# Altium schematic sheet Interface Connector.SchDoc
size A4; Author: Thomas Kreppel; CompanyName: Universidad de Santiago de Chile; Address1: Avenida Ecuador Nº 3519; Address2: Estación Central, Santiago; Address3: Chile; DocumentNumber: 2; SheetNumber: 2; SheetTotal: 5
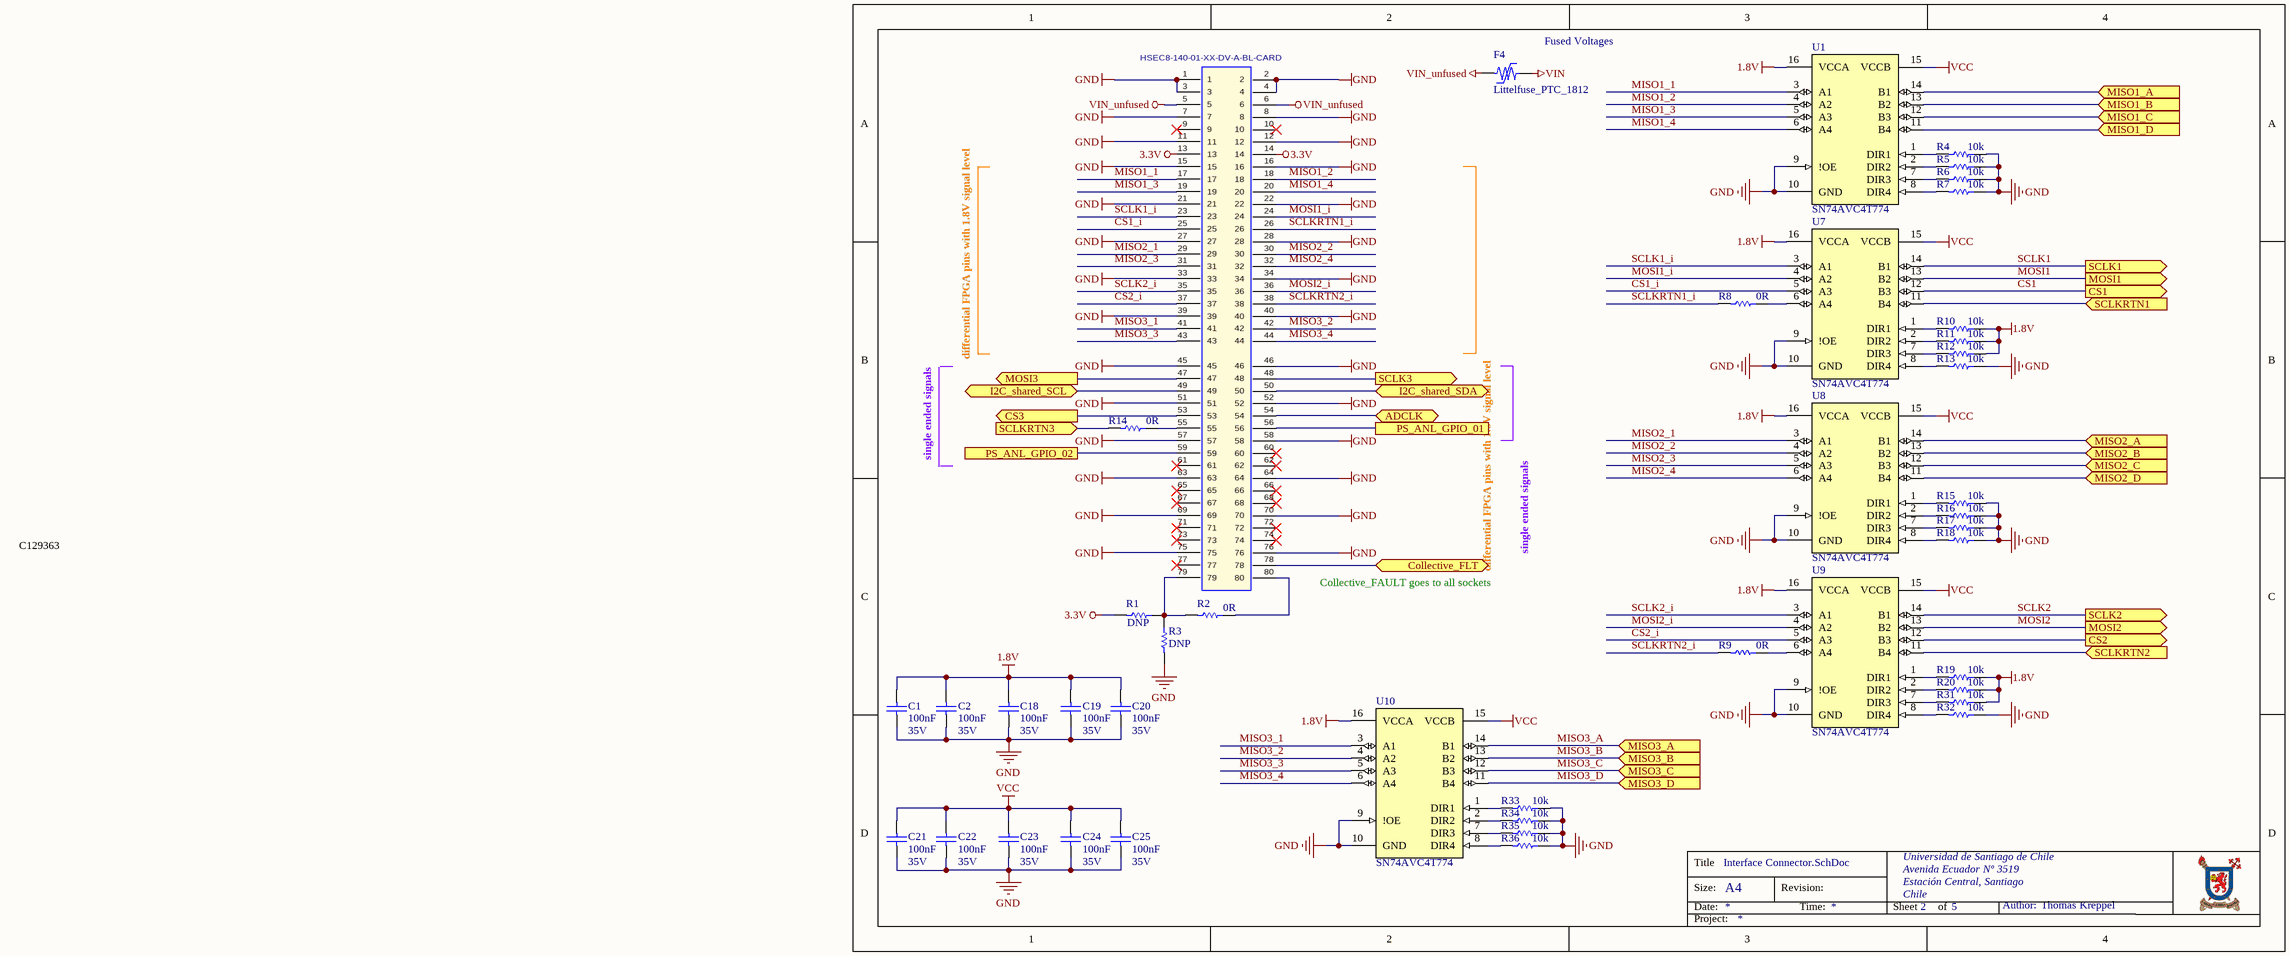
[diagram p0: Interface Connector.SchDoc]

## Parts
C1  100nF  Voltage: 35V  [CAP_0603]
C2  100nF  Voltage: 35V  [CAP_0603]
C18  100nF  Voltage: 35V  [CAP_0603]
C19  100nF  Voltage: 35V  [CAP_0603]
C20  100nF  Voltage: 35V  [CAP_0603]
C21  100nF  Voltage: 35V  [CAP_0603]
C22  100nF  Voltage: 35V  [CAP_0603]
C23  100nF  Voltage: 35V  [CAP_0603]
C24  100nF  Voltage: 35V  [CAP_0603]
C25  100nF  Voltage: 35V  [CAP_0603]
F4  Littelfuse_PTC_1812  [1812_PTC_Polyfuse_Littelfuse]
R1  DNP  [RES_0603]  (no BOM)
R2  0R  [RES_0603]
R3  DNP  [RES_0603]  (no BOM)
R4  10k  [RES_0603]
R5  10k  [RES_0603]
R6  10k  [RES_0603]
R7  10k  [RES_0603]
R8  0R  [RES_0603]
R9  0R  [RES_0603]
R10  10k  [RES_0603]
R11  10k  [RES_0603]
R12  10k  [RES_0603]
R13  10k  [RES_0603]
R14  0R  [RES_0603]
R15  10k  [RES_0603]
R16  10k  [RES_0603]
R17  10k  [RES_0603]
R18  10k  [RES_0603]
R19  10k  [RES_0603]
R20  10k  [RES_0603]
R31  10k  [RES_0603]
R32  10k  [RES_0603]
R33  10k  [RES_0603]
R34  10k  [RES_0603]
R35  10k  [RES_0603]
R36  10k  [RES_0603]
U1  SN74AVC4T774  [TSOP65P640X120-16N]
U7  SN74AVC4T774  [TSOP65P640X120-16N]
U8  SN74AVC4T774  [TSOP65P640X120-16N]
U9  SN74AVC4T774  [TSOP65P640X120-16N]
U10  SN74AVC4T774  [TSOP65P640X120-16N]
X1  HSEC8-140-01-XX-DV-A-BL-CARD  [HSEC8-140-01-XX-DV-A-BL-CARD]  (no BOM)

## Ports
ADCLK (bidir), Collective_FLT (bidir), CS1 (out), CS2 (out), CS3 (out), I2C_shared_SCL (bidir), I2C_shared_SDA (bidir), MISO1_A (in), MISO1_B (in), MISO1_C (in), MISO1_D (in), MISO2_A (in), MISO2_B (in), MISO2_C (in), MISO2_D (in), MISO3_A (in), MISO3_B (in), MISO3_C (in), MISO3_D (in), MOSI1 (out), MOSI2 (out), MOSI3 (out), PS_ANL_GPIO_01, PS_ANL_GPIO_02, SCLK1 (out), SCLK2 (out), SCLK3 (out), SCLKRTN1 (in), SCLKRTN2 (in), SCLKRTN3 (in)

## Nets
1.8V: C1.1 C2.1 C18.1 C19.1 C20.1 R10.1 R11.1 R12.1 R19.1 R20.1 R31.1 U1.16(VCCA) U7.16(VCCA) U8.16(VCCA) U9.16(VCCA) U10.16(VCCA)
3.3V: R1.2 X1.13 X1.14
GND: C1.2 C2.2 C18.2 C19.2 C20.2 C21.2 C22.2 C23.2 C24.2 C25.2 R3.2 R4.1 R5.1 R6.1 R7.1 R13.1 R15.1 R16.1 R17.1 R18.1 R32.1 R33.1 R34.1 R35.1 R36.1 U1.9(!OE) U1.10(GND) U7.9(!OE) U7.10(GND) U8.9(!OE) U8.10(GND) U9.9(!OE) U9.10(GND) U10.9(!OE) U10.10(GND) X1.1 X1.2 X1.3 X1.4 X1.7 X1.8 X1.11 X1.12 X1.15 X1.16 X1.21 X1.22 X1.27 X1.28 X1.33 X1.34 X1.39 X1.40 X1.45 X1.46 X1.51 X1.52 X1.57 X1.58 X1.63 X1.64 X1.69 X1.70 X1.75 X1.76
VCC: C21.1 C22.1 C23.1 C24.1 C25.1 U1.15(VCCB) U7.15(VCCB) U8.15(VCCB) U9.15(VCCB) U10.15(VCCB)
VIN: F4.2
VIN_unfused: F4.1 X1.5 X1.6
ADCLK: X1.54 ; port ADCLK
Collective_FLT: X1.78 ; port Collective_FLT
CS1: U7.12(B3) ; port CS1
CS1_i: U7.5(A3) X1.25
CS2: U9.12(B3) ; port CS2
CS2_i: U9.5(A3) X1.37
CS3: X1.53 ; port CS3
I2C_shared_SCL: X1.49 ; port I2C_shared_SCL
I2C_shared_SDA: X1.50 ; port I2C_shared_SDA
MISO1_1: U1.3(A1) X1.17
MISO1_2: U1.4(A2) X1.18
MISO1_3: U1.5(A3) X1.19
MISO1_4: U1.6(A4) X1.20
MISO1_A: U1.14(B1) ; port MISO1_A
MISO1_B: U1.13(B2) ; port MISO1_B
MISO1_C: U1.12(B3) ; port MISO1_C
MISO1_D: U1.11(B4) ; port MISO1_D
MISO2_1: U8.3(A1) X1.29
MISO2_2: U8.4(A2) X1.30
MISO2_3: U8.5(A3) X1.31
MISO2_4: U8.6(A4) X1.32
MISO2_A: U8.14(B1) ; port MISO2_A
MISO2_B: U8.13(B2) ; port MISO2_B
MISO2_C: U8.12(B3) ; port MISO2_C
MISO2_D: U8.11(B4) ; port MISO2_D
MISO3_1: U10.3(A1) X1.41
MISO3_2: U10.4(A2) X1.42
MISO3_3: U10.5(A3) X1.43
MISO3_4: U10.6(A4) X1.44
MISO3_A: U10.14(B1) ; port MISO3_A
MISO3_B: U10.13(B2) ; port MISO3_B
MISO3_C: U10.12(B3) ; port MISO3_C
MISO3_D: U10.11(B4) ; port MISO3_D
MOSI1: U7.13(B2) ; port MOSI1
MOSI1_i: U7.4(A2) X1.24
MOSI2: U9.13(B2) ; port MOSI2
MOSI2_i: U9.4(A2) X1.36
MOSI3: X1.47 ; port MOSI3
PS_ANL_GPIO_01: X1.56 ; port PS_ANL_GPIO_01
PS_ANL_GPIO_02: X1.59 ; port PS_ANL_GPIO_02
SCLK1: U7.14(B1) ; port SCLK1
SCLK1_i: U7.3(A1) X1.23
SCLK2: U9.14(B1) ; port SCLK2
SCLK2_i: U9.3(A1) X1.35
SCLK3: X1.48 ; port SCLK3
SCLKRTN1: U7.11(B4) ; port SCLKRTN1
SCLKRTN1_i: R8.2 X1.26
SCLKRTN2: U9.11(B4) ; port SCLKRTN2
SCLKRTN2_i: R9.2 X1.38
SCLKRTN3: R14.2 ; port SCLKRTN3
NetR1_1: R1.1 R2.2 R3.1 X1.79
NetR2_1: R2.1 X1.80
NetR4_2: R4.2 U1.1(DIR1)
NetR5_2: R5.2 U1.2(DIR2)
NetR6_2: R6.2 U1.7(DIR3)
NetR7_2: R7.2 U1.8(DIR4)
NetR8_1: R8.1 U7.6(A4)
NetR9_1: R9.1 U9.6(A4)
NetR10_2: R10.2 U7.1(DIR1)
NetR11_2: R11.2 U7.2(DIR2)
NetR12_2: R12.2 U7.7(DIR3)
NetR13_2: R13.2 U7.8(DIR4)
NetR14_1: R14.1 X1.55
NetR15_2: R15.2 U8.1(DIR1)
NetR16_2: R16.2 U8.2(DIR2)
NetR17_2: R17.2 U8.7(DIR3)
NetR18_2: R18.2 U8.8(DIR4)
NetR19_2: R19.2 U9.1(DIR1)
NetR20_2: R20.2 U9.2(DIR2)
NetR31_2: R31.2 U9.7(DIR3)
NetR32_2: R32.2 U9.8(DIR4)
NetR33_2: R33.2 U10.1(DIR1)
NetR34_2: R34.2 U10.2(DIR2)
NetR35_2: R35.2 U10.7(DIR3)
NetR36_2: R36.2 U10.8(DIR4)

Not connected (* = marked no-connect by the designer): X1 9* 10* 60* 61* 62* 65* 66* 67* 68* 71* 72* 73* 74* 77*

## Notes on the sheet
- (near F4) Fused Voltages
- differential FPGA pins with 1.8V signal level
- (near F4) differential FPGA pins with 1.8V signal level
- single ended signals
- C129363
- Collective_FAULT goes to all sockets
- Title
- Size:
- Date:
- A4
- Revision:
- Time:
- Sheet
- of
- Author:
- Project:

## Library data of the parts
C1 C2 C18-C25 = Cap_0603: Capacitor; MPN: C0603C104M5RACTU; Rule: PcbType=ProtelPcb; MF: KEMET; Tolerance: 10%; Dielectricum: X7R; Published: 8-Jun-2000; LatestRevisionDate: 17-Jul-2002; LatestRevisionNote: Re-released for DXP Platform.; PackageReference: RAD-0.3; Publisher: Altium Limited; Value: 100nF; Supplier 1: Digikey; Supplier Part Number 1: 399-7845-1-ND; Package: 0603; LCSC Part Number: C14663
F4 = Littelfuse_PTC_1812: POLYSWITCH RESETTABLE DEVICES; MPN: miniASMDC110F/24; Value: PTC, 1.1 A, 24V; Voltage: 24V; Trip Current: 2.2A; Hold Current: 1.1A; Resistance: 0.18 Ohm; Type: Fuse; Nominal current: 1 A; Created from: MHlatky; MF: Littelfuse; Created: 2019_02_10_AGeiger; Package: 1812; ComponentLink1URL: https://www.littelfuse.com/~/media/electronics/datasheets/resettable_ptcs/littelfuse_ptc_surface_mount_catalog_datasheet.pdf.pdf; ComponentLink1Description: Datasheet; Manufacturer Part Number: Littelfuse_PTC_1812; PartID: 5; Created On: 07.05.2021 06:50:33; Component Type: Littelfuse_PTC_1812; Last Updated: 27.05.2022 15:06:17; Manufacturer: Littelfuse; Mounting Type: SMD; Operating Temperature: -40 - 85 °C; Supplier 1: Mouser; Supplier Part Number 1: 530-0ZCG0150BF2C; Live Cycle Status: 1; LCSC Part Number: C70119
R1 R3 = Res0603: MPN: CRCW06030000Z0EA; Value: 0; Tolerance: 1%; Published: 8-Jun-2000; LatestRevisionDate: 17-Jul-2002; LatestRevisionNote: Re-released for DXP Platform.; PackageReference: AXIAL-0.3; Publisher: Altium Limited; PackageDescription: Axial Device, Thru-Hole; 2 Leads; 0.3 in Pin Spacing; Supplier 1: Digikey; Supplier Part Number 1: 311-0.0GRCT-ND; Package: 0603
R2 = Res0603: MPN: CRCW06030000Z0EA; Tolerance: 1%; Published: 8-Jun-2000; LatestRevisionDate: 17-Jul-2002; LatestRevisionNote: Re-released for DXP Platform.; PackageReference: AXIAL-0.3; Publisher: Altium Limited; PackageDescription: Axial Device, Thru-Hole; 2 Leads; 0.3 in Pin Spacing; Value: 0R; Supplier 1: Digikey; Supplier Part Number 1: 311-0.0GRCT-ND; Package: 0603
R4-R20 R31-R36 = Res0603: Tolerance: 1%; Published: 8-Jun-2000; LatestRevisionDate: 17-Jul-2002; LatestRevisionNote: Re-released for DXP Platform.; PackageReference: AXIAL-0.3; Publisher: Altium Limited; PackageDescription: Axial Device, Thru-Hole; 2 Leads; 0.3 in Pin Spacing; Supplier 1: Digikey; Package: 0603
  R4-R7 R10-R13 R15-R20 R31-R36: Value: 10k; Supplier Part Number 1: 311-10.0KHRCT-ND
  R8 R9 R14: Value: 0R; Supplier Part Number 1: 311-0.0GRCT-ND
U1 U7-U10 = SN74AVC4T774: 4-Bit Dual-Supply Bus Transceiver With Configurable Voltage-Level Shifting and 3-State Outputs With Independent Direction Control Inputs; MPN: SN74AVC4T77PW; MF: Texas Instruments; Created: 2020_05_Kreppel; Supplier 1: Digikey; Supplier Part Number 1: 296-23611-5-ND; LCSC Part Number: C129363
  U7-U10: Parameter 1: *
X1 = HSEC8-140-01-XX-DV-A-BL-CARD: Mating Card Layout for HSEC8-140-01-XX-DV-A-BL; MF: SAMTEC; Created: 2018_04_23_AGeiger; Value: HSEC8-140-01-XX-DV-A-BL-CARD